# EAGLE design 555_project_555timer_ic_revA (EAGLE 7.6.0)
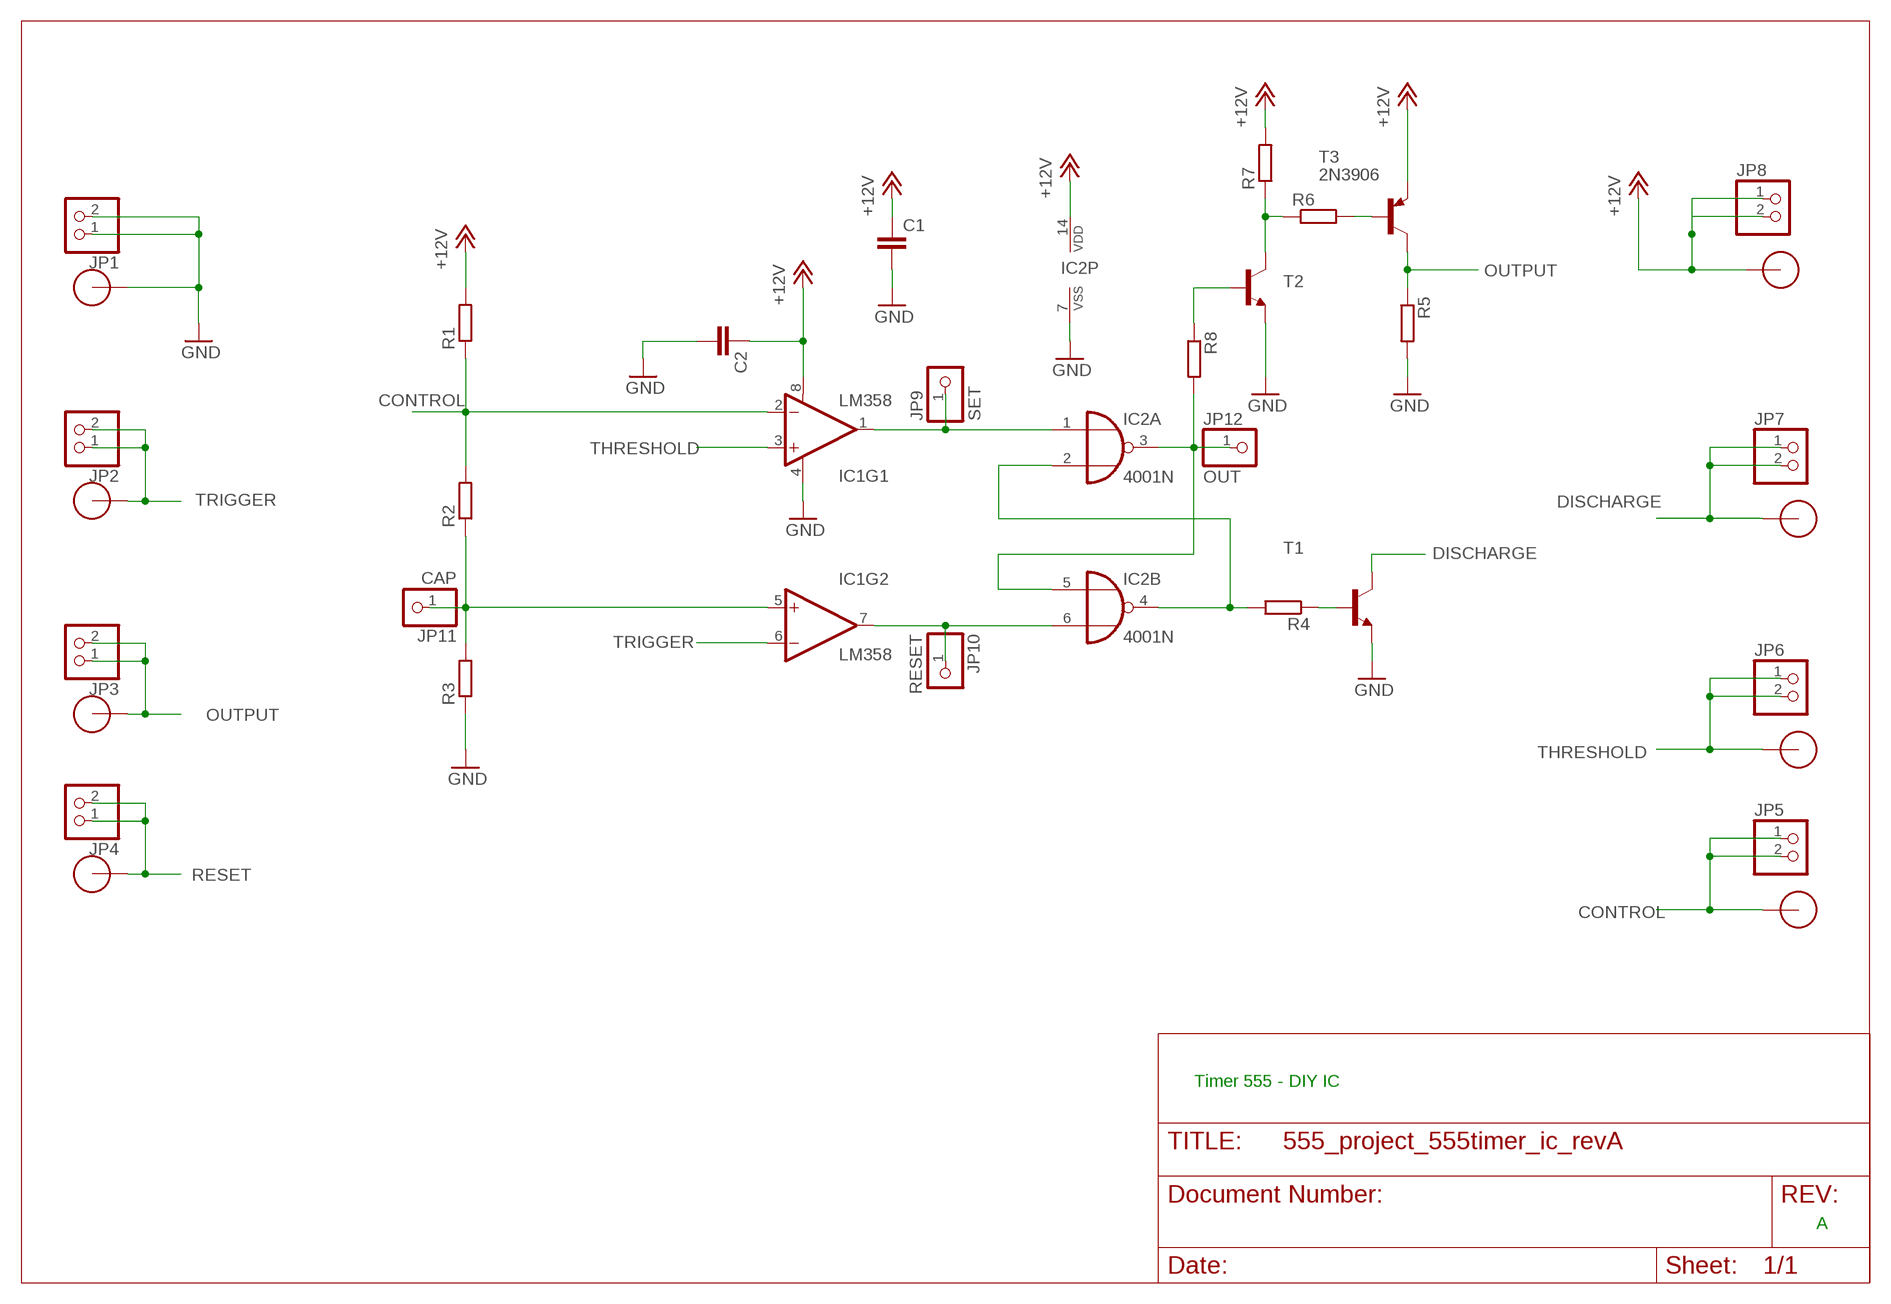
[diagram p0: schematic, sheet 1]

## Parts
C1  C-EU025-024X044  [C025-024X044]
C2  C-EU025-024X044  [C025-024X044]
IC1  LM358  [DIP08]
IC2  4001N  [DIL14]
JP1  PINHD-1X2  [1X02]
JP2  PINHD-1X2  [1X02]
JP3  PINHD-1X2  [1X02]
JP4  PINHD-1X2  [1X02]
JP5  PINHD-1X2  [1X02]
JP6  PINHD-1X2  [1X02]
JP7  PINHD-1X2  [1X02]
JP8  PINHD-1X2  [1X02]
JP9  SET  PINHD-1X1  [1X01]
JP10  RESET  PINHD-1X1  [1X01]
JP11  CAP  PINHD-1X1  [1X01]
JP12  OUT  PINHD-1X1  [1X01]
R1  R-EU_0204/7  [0204/7]
R2  R-EU_0204/7  [0204/7]
R3  R-EU_0204/7  [0204/7]
R4  R-EU_0204/7  [0204/7]
R5  R-EU_0204/7  [0204/7]
R6  R-EU_0204/7  [0204/7]
R7  R-EU_0204/7  [0204/7]
R8  R-EU_0204/7  [0204/7]
T1  BC546-NPN-TO92-CBE  [TO92-CBE]
T2  TRANSISTOR_NPN2N3904  [TO-92]
T3  2N3906  [TO92]
U$1  ALLIGATOR_CLIP_PAD  [BIGTAP]
U$3  ALLIGATOR_CLIP_PAD  [BIGTAP]
U$4  ALLIGATOR_CLIP_PAD  [BIGTAP]
U$5  ALLIGATOR_CLIP_PAD  [BIGTAP]
U$6  ALLIGATOR_CLIP_PAD  [BIGTAP]
U$7  ALLIGATOR_CLIP_PAD  [BIGTAP]
U$8  ALLIGATOR_CLIP_PAD  [BIGTAP]
U$9  ALLIGATOR_CLIP_PAD  [BIGTAP]

## Nets
+12V: C1.1 C2.1 IC1.8(V+) IC2.14(P:VDD) JP8.1 JP8.2 R1.2 R7.2 T3.3(E) U$7.P$1
CONTROL: IC1.2(-IN) JP5.1 JP5.2 R1.1 R2.2 U$1.P$1
DISCHARGE: JP7.1 JP7.2 T1.C U$8.P$1
GND: C1.2 C2.2 IC1.4(V-) IC2.7(P:VSS) JP1.1 JP1.2 R3.1 R5.2 T1.E T2.1(E) U$3.P$1
N$1: IC2.2(A:I1) IC2.4(B:O) R4.2
N$2: R4.1 T1.B
N$3: R8.1 T2.2(B)
N$4: IC1.7(OUT) IC2.6(B:I1) JP10.1
N$5: IC1.5(+IN) JP11.1 R2.1 R3.2
N$6: IC1.1(OUT) IC2.1(A:I0) JP9.1
N$7: R6.1 R7.1 T2.3(C)
N$8: R6.2 T3.2(B)
OUT: IC2.3(A:O) IC2.5(B:I0) JP12.1 R8.2
OUTPUT: JP3.1 JP3.2 R5.1 T3.1(C) U$5.P$1
RESET: JP4.1 JP4.2 U$6.P$1
THRESHOLD: IC1.3(+IN) JP6.1 JP6.2 U$9.P$1
TRIGGER: IC1.6(-IN) JP2.1 JP2.2 U$4.P$1
Unconnected: IC2.8(C:I0) IC2.9(C:I1) IC2.10(C:O) IC2.11(D:O) IC2.12(D:I0) IC2.13(D:I1)

## Notes on the sheet
- Timer 555 - DIY IC
- A

## Library data of the parts
C1 C2 = resistor:C-EU: CAPACITOR, European symbol
IC1 = SparkFun-AnalogIC:LM358: Jellybean op-amp; PROD_ID: IC-09172
IC2 = 40xx:4001: Quad 2-input NOR
JP1-JP8 = pinhead:PINHD-1X2: PIN HEADER
JP9-JP12 = pinhead:PINHD-1X1: PIN HEADER
R1-R8 = resistor:R-EU_: RESISTOR, European symbol
T1 = transistor:*-NPN-: NPN Transistror BF959 corrected 2008.03.06
T2 = SparkFun-DiscreteSemi:TRANSISTOR_NPN: Generic NPN BJT MMBT2222A - TRANS-08049 (SOT-23, 1A 40V) MPSA42 - TRANS-09116 (SOT-23, 500mA 300V) MMBT5088LT1G - TRANS-11160 (SOT-23, 50 mA 30V) BC547 - COM-08928 <http://www.sparkfun.com/products/8928> (TO-92 45V 100mA) (1.Collector 2.Base 3.Emitter) 2N3904 - COM-00521 <http://www.sparkfun.com/products/521> (TO-92 40V 200mA) (1.Emitter 2.Base 3.Collector) P2N2222A - COM-12852 <http://www.sparkfun.com/products/12852> (TO-92 40V 600mA) (1.Collector 2.Base 3.Emitter); PROD_ID: TRANS-08447
T3 = transistor-pnp:2N3906: PNP Transistor
U$1 U$3-U$9 = Tristan+Robitaille's+Library:ALLIGATOR_CLIP_PAD

## Board
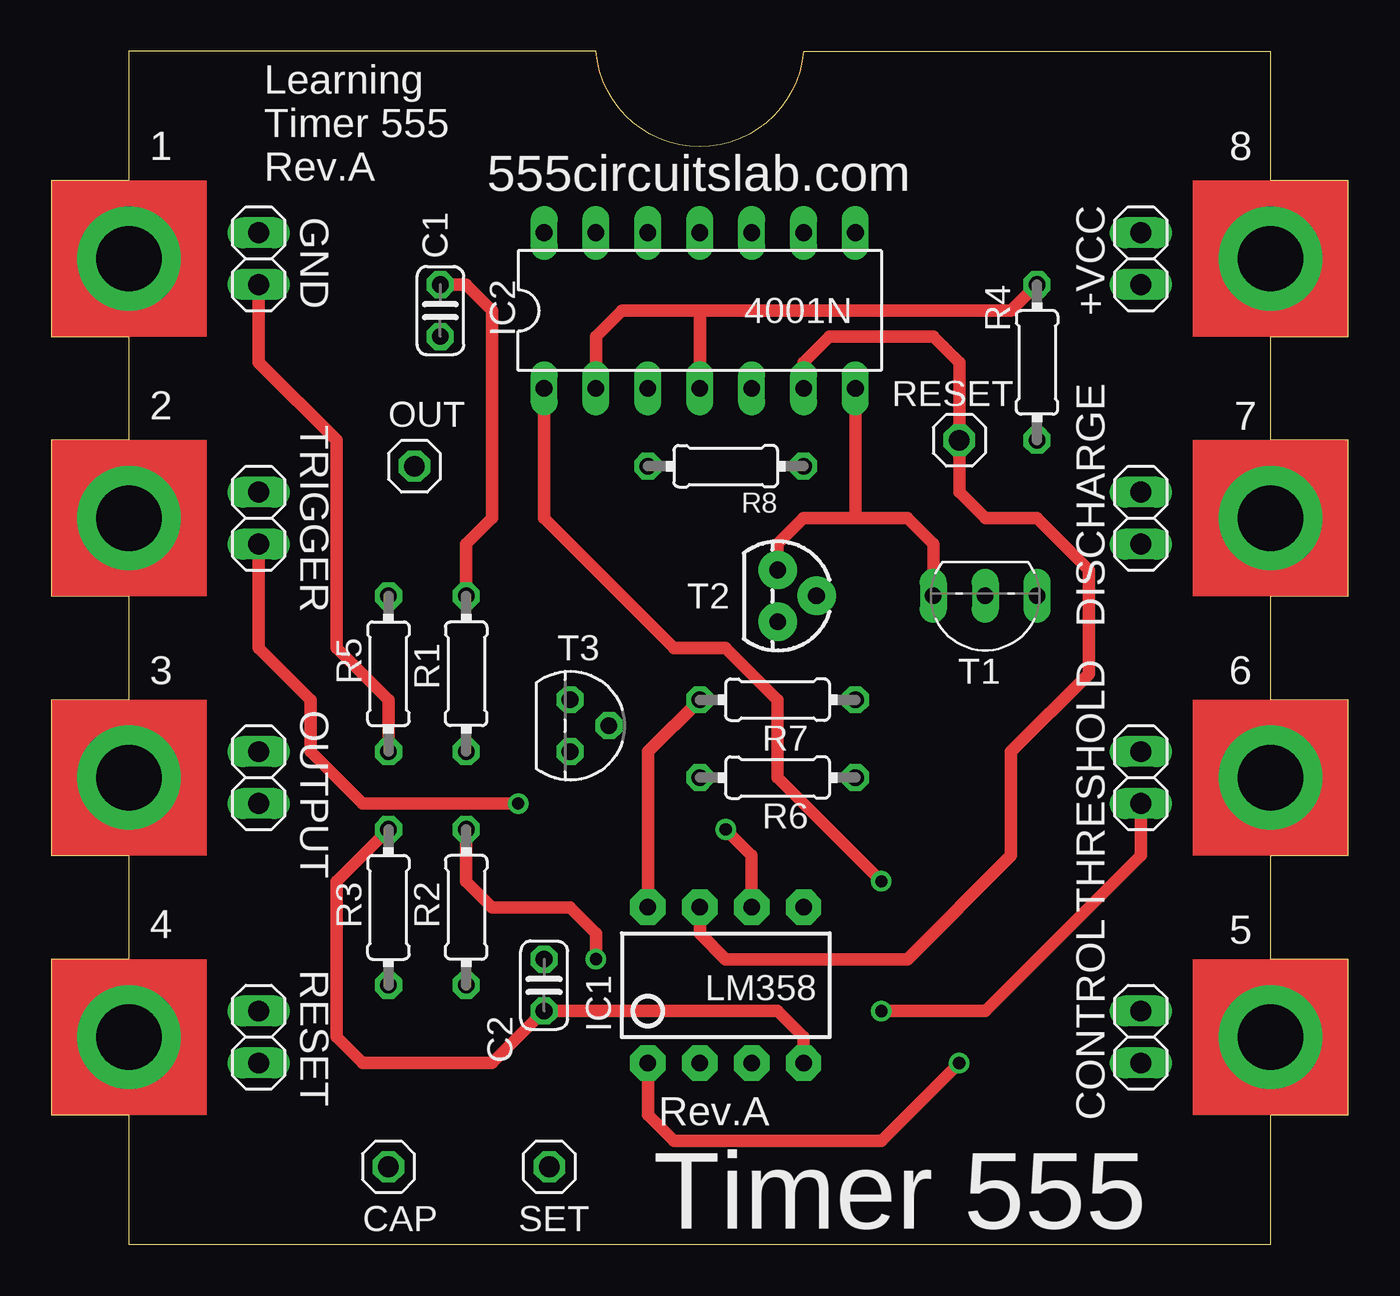
[diagram p1: board, top side]
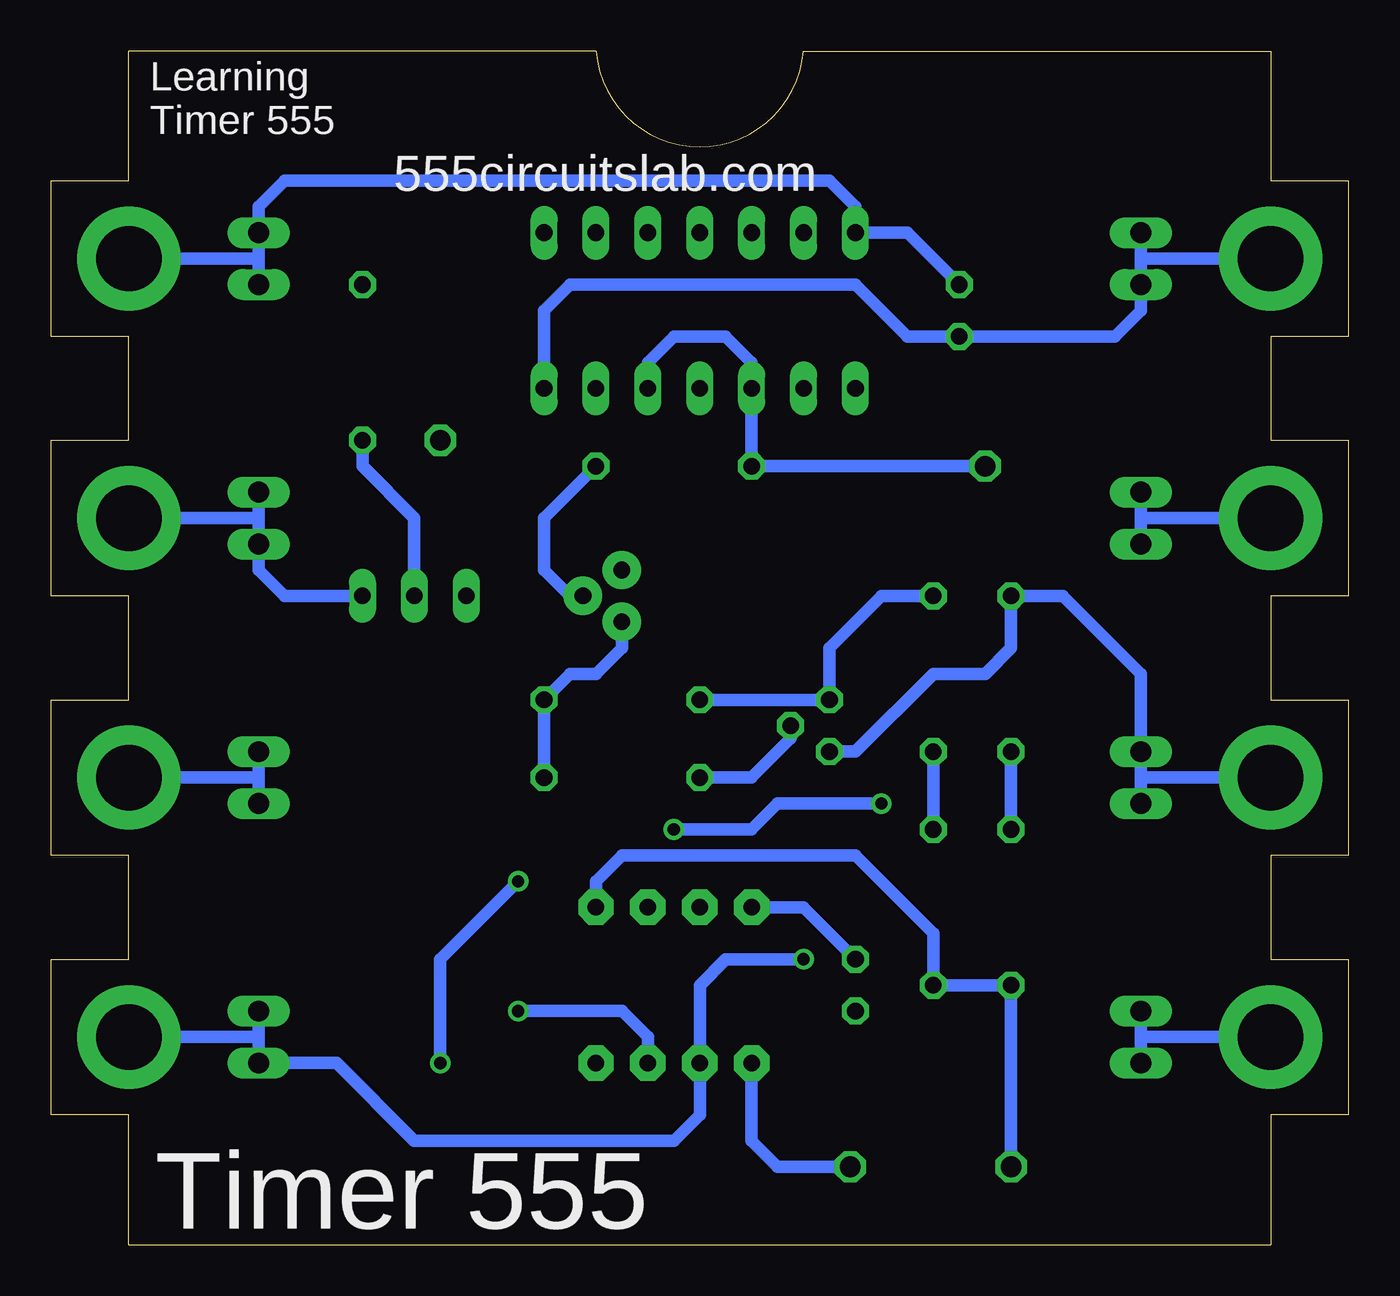
[diagram p2: board, bottom side, seen from below]

Size 63.5 x 58.42 mm. Coordinates in mm from the lower left corner, seen from the top.
Outline: 59.69,0 3.81,0 3.81,6.35 0,6.35 0,13.97 3.81,13.97 3.81,19.05 0,19.05 0,26.67 3.81,26.67 3.81,31.75 0,31.75 0,39.37 3.81,39.37 3.81,44.45 0,44.45 0,52.07 3.81,52.07 3.81,58.42 26.67,58.42 arc170 36.83,58.42 59.69,58.42 59.69,52.07 63.5,52.07 63.5,44.45 59.69,44.45 59.69,39.37 63.5,39.37 63.5,31.75 59.69,31.75 59.69,26.67 63.5,26.67 63.5,19.05 59.69,19.05 59.69,13.97 63.5,13.97 63.5,6.35 59.69,6.35 59.69,0
Copper layers (1*16): Top 0.035mm / dielectric 1.5mm / Bottom 0.035mm
Design rules "default": minimum track width 10mil, minimum drill 24mil, track to track 8mil, track to pad 8mil, pad to pad 8mil, via to via 8mil, smd to smd 8mil, copper to edge 40mil, drill to drill 8mil, minimum pad ring 10mil, minimum via ring 8mil, stop-mask expansion 4mil, vias tented up to drill 0mil, thermal gap 10mil

### Footprints (pad centres in the part's own frame; a part is rotated, then mirrored left to right if it is on the bottom)
C025-024X044 = drill 0.813 octagon: 1 -1.27,0; 2 1.27,0
DIP08 = drill 0.813 pad 1.727 octagon: 1 -3.81,-3.81; 2 -1.27,-3.81; 3 1.27,-3.81; 4 3.81,-3.81; 5 3.81,3.81; 6 1.27,3.81; 7 -1.27,3.81; 8 -3.81,3.81
DIL14 = drill 0.813 long: 1 -7.62,-3.81; 2 -5.08,-3.81; 3 -2.54,-3.81; 4 0,-3.81; 5 2.54,-3.81; 6 5.08,-3.81; 7 7.62,-3.81; 8 7.62,3.81; 9 5.08,3.81; 10 2.54,3.81; 11 0,3.81; 12 -2.54,3.81; 13 -5.08,3.81; 14 -7.62,3.81
1X02 = drill 1.016 long: 1 -1.27,0; 2 1.27,0
1X01 = drill 1.016 octagon: 1 0,0
0204/7 = drill 0.813 octagon: 1 -3.81,0; 2 3.81,0
TO92-CBE = drill 0.813 long: B 0,0; C -2.54,0; E 2.54,0
TO-92 = drill 0.813 pad 1.88: 1 -1.27,0; 2 0,1.905; 3 1.27,0
TO92 = drill 0.813 octagon: 1 1.27,0; 2 0,1.905; 3 -1.27,0
BIGTAP = drill 3.2 pad 5.08: P$1 0,0

### Placement (x,y rotation side)
C1  19.05,45.72 270 top
C2  24.13,12.7 270 top
IC1  33.02,12.7 0 top
IC2  31.75,45.72 0 top
JP1  10.16,48.26 90 top
JP2  10.16,35.56 90 top
JP3  10.16,22.86 90 top
JP4  10.16,10.16 90 top
JP5  53.34,10.16 90 top
JP6  53.34,22.86 90 top
JP7  53.34,35.56 90 top
JP8  53.34,48.26 90 top
JP9  24.38,3.81 0 top
JP10  44.45,39.37 0 top
JP11  16.51,3.81 0 top
JP12  17.78,38.1 0 top
R1  20.32,27.94 90 top
R2  20.32,16.51 90 top
R3  16.51,16.51 270 top
R4  48.26,43.18 90 top
R5  16.51,27.94 270 top
R6  35.56,22.86 180 top
R7  35.56,26.67 180 top
R8  33.02,38.1 180 top
T1  45.72,31.75 180 top
T2  35.56,31.75 270 top
T3  25.4,25.4 270 top
U$1  59.69,10.16 270 top
U$3  3.81,48.26 0 top
U$4  3.81,35.56 0 top
U$5  3.81,22.86 0 top
U$6  3.81,10.16 0 top
U$7  59.69,48.26 0 top
U$8  59.69,35.56 0 top
U$9  59.69,22.86 0 top

### Tracks (layer width: path | path; a pad name or v marks a point on that pad's centre or on a via)
+12V
  Top 0.61: R1.2 20.32,34.29 21.59,35.56 21.59,45.72 20.32,46.99 C1.1 | IC1.8 29.21,24.13 R7.2
  Bottom 0.61: 53.34,48.26 JP8.2 53.34,50.8 52.07,52.07 25.4,52.07 24.13,50.8 IC2.14 21.59,49.53 C1.1 | 53.34,48.26 JP8.1 | U$7.P$1 53.34,48.26 | R7.2 T3.3 25.4,29.21 22.86,31.75 R1.2 | IC1.8 26.67,16.51 C2.1
CONTROL  (via drill 0.6)
  Top 0.61: v26.67,13.97 26.67,15.24 25.4,16.51 21.59,16.51 20.32,17.78 R2.2
  Bottom 0.61: JP5.2 53.34,10.16 | 53.34,10.16 JP5.1 49.53,8.89 45.72,5.08 33.02,5.08 31.75,6.35 IC1.2 31.75,12.7 30.48,13.97 v26.67,13.97 | U$1.P$1 53.34,10.16 | R1.1 R2.2
DISCHARGE
  Bottom 0.61: JP7.2 53.34,35.56 | 53.34,35.56 JP7.1 53.34,33.02 52.07,31.75 T1.C | U$8.P$1 53.34,35.56
GND
  Top 0.61: T2.1 35.56,34.29 36.83,35.56 39.37,35.56 | 39.37,35.56 IC2.7 | 39.37,35.56 41.91,35.56 43.18,34.29 T1.E | IC1.4 36.83,10.16 35.56,11.43 C2.2 21.59,8.89 15.24,8.89 13.97,10.16 13.97,17.78 R3.1 | JP1.1 10.16,43.18 13.97,39.37 13.97,29.21 16.51,26.67 R5.2
  Bottom 0.61: JP1.2 10.16,48.26 | 10.16,48.26 JP1.1 10.16,45.72 11.43,44.45 C1.2 21.59,44.45 24.13,46.99 38.1,46.99 39.37,45.72 IC2.7 | U$3.P$1 10.16,48.26 | R5.2 R3.1
N$1
  Top 0.61: IC2.4 31.75,45.72 | 31.75,45.72 27.94,45.72 26.67,44.45 IC2.2 | 31.75,45.72 46.99,45.72 R4.2
N$2
  Bottom 0.61: R4.1 48.26,38.1 45.72,35.56 T1.B
N$3
  Bottom 0.61: R8.1 39.37,35.56 39.37,33.02 38.1,31.75 T2.2
N$4
  Top 0.61: IC2.6 36.83,43.18 38.1,44.45 43.18,44.45 44.45,43.18 JP10.1 44.45,36.83 45.72,35.56 48.26,35.56 50.8,33.02 50.8,27.94 46.99,24.13 46.99,19.05 41.91,13.97 33.02,13.97 31.75,15.24 IC1.7
N$5
  Bottom 0.61: JP11.1 R3.2 R2.1 20.32,15.24 24.13,19.05 35.56,19.05 36.83,17.78 IC1.5
N$6  (via drill 0.6)
  Top 0.61: IC2.1 24.13,35.56 30.48,29.21 33.02,29.21 35.56,26.67 35.56,22.86 v40.64,17.78 | v44.45,8.89 40.64,5.08 30.48,5.08 29.21,6.35 IC1.1
  Bottom 0.61: IC1.1 29.21,5.08 27.94,3.81 JP9.1 | v40.64,17.78 44.45,13.97 v44.45,8.89
N$7
  Bottom 0.61: R6.1 R7.1 38.1,27.94 36.83,27.94 35.56,29.21 T2.3
N$8
  Bottom 0.61: T3.2 27.3,24.77 29.21,22.86 R6.2
OUT
  Bottom 0.61: JP12.1 R8.2 IC2.3 29.21,43.18 30.48,44.45 33.02,44.45 34.29,43.18 IC2.5
OUTPUT
  Bottom 0.61: 10.16,22.86 JP3.2 10.16,27.94 13.97,31.75 R5.1 16.51,29.21 17.78,27.94 20.32,27.94 24.13,24.13 T3.1 | 10.16,22.86 JP3.1 | U$5.P$1 10.16,22.86
RESET
  Bottom 0.61: JP4.1 10.16,10.16 | 10.16,10.16 JP4.2 | U$6.P$1 10.16,10.16
THRESHOLD  (via drill 0.6)
  Top 0.61: v40.64,11.43 45.72,11.43 53.34,19.05 JP6.1
  Bottom 0.61: JP6.2 53.34,22.86 | 53.34,22.86 JP6.1 | U$9.P$1 53.34,22.86 | IC1.3 34.29,10.16 35.56,11.43 v40.64,11.43
TRIGGER  (via drill 0.6)
  Top 0.61: IC1.6 34.29,19.05 v33.02,20.32 | v22.86,21.59 15.24,21.59 12.7,24.13 12.7,26.67 10.16,29.21 JP2.1
  Bottom 0.61: JP2.2 10.16,35.56 | 10.16,35.56 JP2.1 | U$4.P$1 10.16,35.56 | v33.02,20.32 29.21,20.32 27.94,21.59 v22.86,21.59

### Text on the board
tPlace: 1 | 8 | Learning / Timer 555 / Rev.A | 555circuitslab.com | GND | +VCC | 2 | TRIGGER | 7 | DISCHARGE | 3 | 6 | OUTPUT | THRESHOLD | 4 | 5 | RESET | Rev.A | CONTROL | Timer 555
bPlace: Learning / Timer 555 | 555circuitslab.com | Timer 555